# EasyEDA Pro project ProPrj_ESP32-CNC_2025-08-15.epro, schematic Schematic1
Board Name: Board1; Create Date: 2025-08-11; Page Name: P1; Project Name: ESP32-CNC; Schematic Name: Schematic1; Update Date: 2025-08-14; Company: EasyEDA.com; Page Size: A2; Version: V1.0
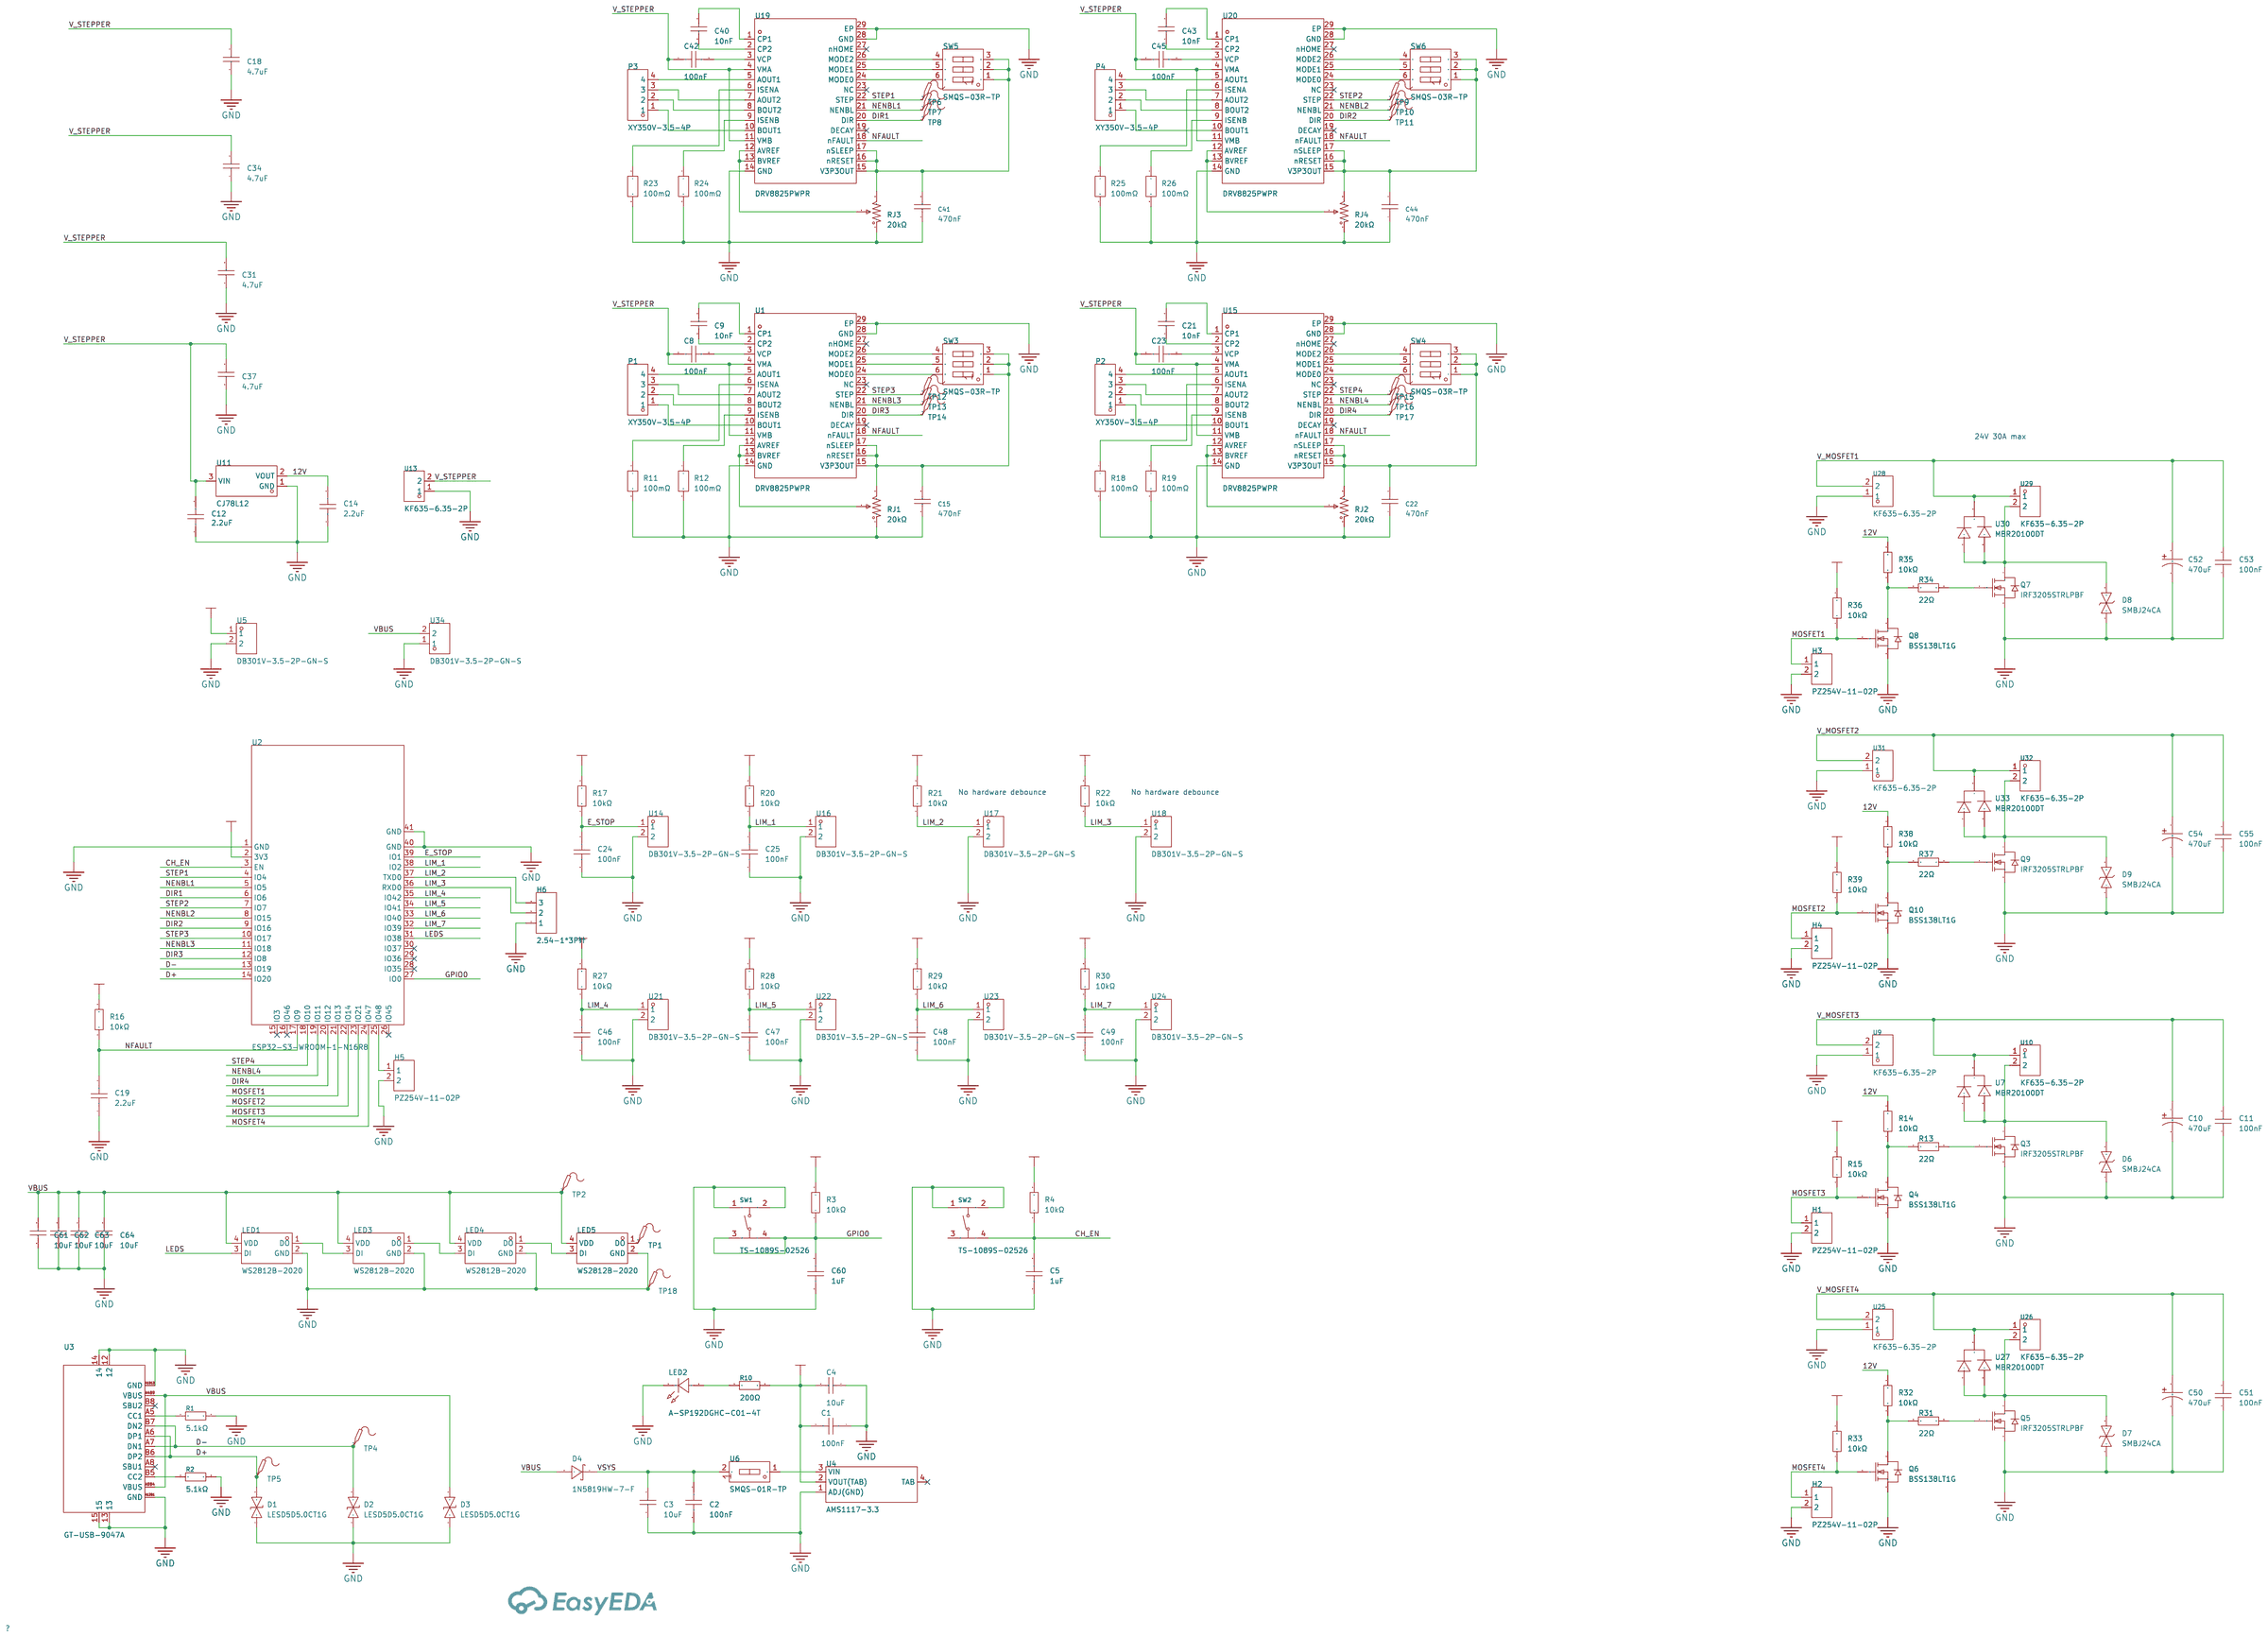
[diagram p0: schematic sheet]

## Parts
C1  100nF  [C0805]
C2  100nF  [C0805]
C3  10uF  [C0402]
C4  10uF  [C0402]
C5  1uF  [C0402]
C8  100nF  [C0805]
C9  10nF  [C0805]
C10  470uF  [CAP-SMD_BD12.5-L13.0-W13.0-RD]
C11  100nF  [C0805]
C12  2.2uF  [C0805]
C14  2.2uF  [C0805]
C15  470nF  [C0805]
C18  4.7uF  [C1206]
C19  2.2uF  [C0805]
C21  10nF  [C0805]
C22  470nF  [C0805]
C23  100nF  [C0805]
C24  100nF  [C0805]
C25  100nF  [C0805]
C31  4.7uF  [C1206]
C34  4.7uF  [C1206]
C37  4.7uF  [C1206]
C40  10nF  [C0805]
C41  470nF  [C0805]
C42  100nF  [C0805]
C43  10nF  [C0805]
C44  470nF  [C0805]
C45  100nF  [C0805]
C46  100nF  [C0805]
C47  100nF  [C0805]
C48  100nF  [C0805]
C49  100nF  [C0805]
C50  470uF  [CAP-SMD_BD12.5-L13.0-W13.0-RD]
C51  100nF  [C0805]
C52  470uF  [CAP-SMD_BD12.5-L13.0-W13.0-RD]
C53  100nF  [C0805]
C54  470uF  [CAP-SMD_BD12.5-L13.0-W13.0-RD]
C55  100nF  [C0805]
C60  1uF  [C0402]
C61  10uF  [C0402]
C62  10uF  [C0402]
C63  10uF  [C0402]
C64  10uF  [C0402]
D1  LESD5D5.0CT1G  [SOD-523_L1.2-W0.8-LS1.6-BI]
D2  LESD5D5.0CT1G  [SOD-523_L1.2-W0.8-LS1.6-BI]
D3  LESD5D5.0CT1G  [SOD-523_L1.2-W0.8-LS1.6-BI]
D4  1N5819HW-7-F  [SOD-123_L2.7-W1.6-LS3.7-RD]
D6  SMBJ24CA  [SMBG_L4.3-W3.6-LS6.2-BI]
D7  SMBJ24CA  [SMBG_L4.3-W3.6-LS6.2-BI]
D8  SMBJ24CA  [SMBG_L4.3-W3.6-LS6.2-BI]
D9  SMBJ24CA  [SMBG_L4.3-W3.6-LS6.2-BI]
H1  PZ254V-11-02P  [HDR-TH_2P-P2.54-V-M]
H2  PZ254V-11-02P  [HDR-TH_2P-P2.54-V-M]
H3  PZ254V-11-02P  [HDR-TH_2P-P2.54-V-M]
H4  PZ254V-11-02P  [HDR-TH_2P-P2.54-V-M]
H5  PZ254V-11-02P  [HDR-TH_2P-P2.54-V-M]
H6  2.54-1*3P针  [HDR-TH_3P-P2.54-V-M-1]
LED1  WS2812B-2020  [LED-SMD_4P-L2.0-W2.0-TL_WS2812B-2020]
LED2  A-SP192DGHC-C01-4T  [LED0603-FD]
LED3  WS2812B-2020  [LED-SMD_4P-L2.0-W2.0-TL_WS2812B-2020]
LED4  WS2812B-2020  [LED-SMD_4P-L2.0-W2.0-TL_WS2812B-2020]
LED5  WS2812B-2020  [LED-SMD_4P-L2.0-W2.0-TL_WS2812B-2020]
P1  XY350V-3.5-4P  [CONN-TH_XY350V-3.5-4P]
P2  XY350V-3.5-4P  [CONN-TH_XY350V-3.5-4P]
P3  XY350V-3.5-4P  [CONN-TH_XY350V-3.5-4P]
P4  XY350V-3.5-4P  [CONN-TH_XY350V-3.5-4P]
Q3  IRF3205STRLPBF  [TO-263-2_L10.0-W9.1-P5.08-LS15.2-TL]
Q4  BSS138LT1G  [SOT-23-3_L2.9-W1.6-P1.90-LS2.8-BR]
Q5  IRF3205STRLPBF  [TO-263-2_L10.0-W9.1-P5.08-LS15.2-TL]
Q6  BSS138LT1G  [SOT-23-3_L2.9-W1.6-P1.90-LS2.8-BR]
Q7  IRF3205STRLPBF  [TO-263-2_L10.0-W9.1-P5.08-LS15.2-TL]
Q8  BSS138LT1G  [SOT-23-3_L2.9-W1.6-P1.90-LS2.8-BR]
Q9  IRF3205STRLPBF  [TO-263-2_L10.0-W9.1-P5.08-LS15.2-TL]
Q10  BSS138LT1G  [SOT-23-3_L2.9-W1.6-P1.90-LS2.8-BR]
R1  5.1kΩ  [R0402]
R2  5.1kΩ  [R0402]
R3  10kΩ  [R0402]
R4  10kΩ  [R0402]
R10  200Ω  [R0402]
R11  100mΩ  [R1206]
R12  100mΩ  [R1206]
R13  22Ω  [R0603]
R14  10kΩ  [R0402]
R15  10kΩ  [R0402]
R16  10kΩ  [R0402]
R17  10kΩ  [R0402]
R18  100mΩ  [R1206]
R19  100mΩ  [R1206]
R20  10kΩ  [R0402]
R21  10kΩ  [R0402]
R22  10kΩ  [R0402]
R23  100mΩ  [R1206]
R24  100mΩ  [R1206]
R25  100mΩ  [R1206]
R26  100mΩ  [R1206]
R27  10kΩ  [R0402]
R28  10kΩ  [R0402]
R29  10kΩ  [R0402]
R30  10kΩ  [R0402]
R31  22Ω  [R0603]
R32  10kΩ  [R0402]
R33  10kΩ  [R0402]
R34  22Ω  [R0603]
R35  10kΩ  [R0402]
R36  10kΩ  [R0402]
R37  22Ω  [R0603]
R38  10kΩ  [R0402]
R39  10kΩ  [R0402]
RJ1  20kΩ  [RES-ADJ-SMD_TC33X-2-104E]
RJ2  20kΩ  [RES-ADJ-SMD_TC33X-2-104E]
RJ3  20kΩ  [RES-ADJ-SMD_TC33X-2-104E]
RJ4  20kΩ  [RES-ADJ-SMD_TC33X-2-104E]
SW1  TS-1089S-02526  [SW-SMD_4P-L4.2-W3.3-P2.15-LS5.1]
SW2  TS-1089S-02526  [SW-SMD_4P-L4.2-W3.3-P2.15-LS5.1]
SW3  SMQS-03R-TP  [SW-TH_SMQS-03B-TP]
SW4  SMQS-03R-TP  [SW-TH_SMQS-03B-TP]
SW5  SMQS-03R-TP  [SW-TH_SMQS-03B-TP]
SW6  SMQS-03R-TP  [SW-TH_SMQS-03B-TP]
TP1  -  [Test-Point-0.5mm]
TP2  -  [Test-Point-0.5mm]
TP4  -  [Test-Point-0.5mm]
TP5  -  [Test-Point-0.5mm]
TP6  -  [Test-Point-0.5mm]
TP7  -  [Test-Point-0.5mm]
TP8  -  [Test-Point-0.5mm]
TP9  -  [Test-Point-0.5mm]
TP10  -  [Test-Point-0.5mm]
TP11  -  [Test-Point-0.5mm]
TP12  -  [Test-Point-0.5mm]
TP13  -  [Test-Point-0.5mm]
TP14  -  [Test-Point-0.5mm]
TP15  -  [Test-Point-0.5mm]
TP16  -  [Test-Point-0.5mm]
TP17  -  [Test-Point-0.5mm]
TP18  -  [Test-Point-0.5mm]
U1  DRV8825PWPR  [HTSSOP-28_L9.7-W4.4-P0.65-LS6.4-BL-EP]
U2  ESP32-S3-WROOM-1-N16R8  [WIRELM-SMD_ESP32-S3-WROOM-1]
U3  GT-USB-9047A  [USB-C-SMD_GT-USB-9047A]
U4  AMS1117-3.3  [SOT-223-4_L6.5-W3.5-P2.30-LS7.0-BR]
U5  DB301V-3.5-2P-GN-S  [CONN-TH_DB301V-3.5-2P-GN]
U6  SMQS-01R-TP  [SW-TH_KF1001-01P-B0-FL-ON-01B]
U7  MBR20100DT  [TO-252-2_L6.5-W6.1-P4.58-LS10.0-BL]
U9  KF635-6.35-2P  [CONN-TH_P6.35_KF635-6.35-2P]
U10  KF635-6.35-2P  [CONN-TH_P6.35_KF635-6.35-2P]
U11  CJ78L12  [SOT-89-3_L4.5-W2.5-P1.50-LS4.2-BR]
U13  KF635-6.35-2P  [CONN-TH_P6.35_KF635-6.35-2P]
U14  DB301V-3.5-2P-GN-S  [CONN-TH_DB301V-3.5-2P-GN]
U15  DRV8825PWPR  [HTSSOP-28_L9.7-W4.4-P0.65-LS6.4-BL-EP]
U16  DB301V-3.5-2P-GN-S  [CONN-TH_DB301V-3.5-2P-GN]
U17  DB301V-3.5-2P-GN-S  [CONN-TH_DB301V-3.5-2P-GN]
U18  DB301V-3.5-2P-GN-S  [CONN-TH_DB301V-3.5-2P-GN]
U19  DRV8825PWPR  [HTSSOP-28_L9.7-W4.4-P0.65-LS6.4-BL-EP]
U20  DRV8825PWPR  [HTSSOP-28_L9.7-W4.4-P0.65-LS6.4-BL-EP]
U21  DB301V-3.5-2P-GN-S  [CONN-TH_DB301V-3.5-2P-GN]
U22  DB301V-3.5-2P-GN-S  [CONN-TH_DB301V-3.5-2P-GN]
U23  DB301V-3.5-2P-GN-S  [CONN-TH_DB301V-3.5-2P-GN]
U24  DB301V-3.5-2P-GN-S  [CONN-TH_DB301V-3.5-2P-GN]
U25  KF635-6.35-2P  [CONN-TH_P6.35_KF635-6.35-2P]
U26  KF635-6.35-2P  [CONN-TH_P6.35_KF635-6.35-2P]
U27  MBR20100DT  [TO-252-2_L6.5-W6.1-P4.58-LS10.0-BL]
U28  KF635-6.35-2P  [CONN-TH_P6.35_KF635-6.35-2P]
U29  KF635-6.35-2P  [CONN-TH_P6.35_KF635-6.35-2P]
U30  MBR20100DT  [TO-252-2_L6.5-W6.1-P4.58-LS10.0-BL]
U31  KF635-6.35-2P  [CONN-TH_P6.35_KF635-6.35-2P]
U32  KF635-6.35-2P  [CONN-TH_P6.35_KF635-6.35-2P]
U33  MBR20100DT  [TO-252-2_L6.5-W6.1-P4.58-LS10.0-BL]
U34  DB301V-3.5-2P-GN-S  [CONN-TH_DB301V-3.5-2P-GN]

## Library data of the parts
C1 C2 C8 C11 C23-C25 C42 C45-C49 C51 C53 C55 = CL21B104KCFNNNE: Capacitance: Tolerance:±10% Tolerance:±10% Voltage Rated: Temperature Coefficient:; LCSC Part Name: 100nF ±10% 100V; Supplier Part: C28233; Manufacturer: SAMSUNG(三星); Supplier Footprint: 0805; JLCPCB Part Class: Basic Part; Datasheet: https://atta.szlcsc.com/upload/public/pdf/source/20160218/1457707763339.pdf; Supplier: LCSC; Tolerance: ±10%
C3 C4 C61-C64 = CL05A106MQ5NUNC: Capacitance: Tolerance:±20% Tolerance:±20% Voltage Rated: Temperature Coefficient:; LCSC Part Name: 10uF ±20% 6.3V; Supplier Part: C15525; Manufacturer: SAMSUNG(三星); Supplier Footprint: 0402; JLCPCB Part Class: Basic Part; Datasheet: https://atta.szlcsc.com/upload/public/pdf/source/20220823/2B02EE04F8F211D38A52DCB16EB6BEBA.pdf; Supplier: LCSC; Tolerance: ±20%
C5 C60 = CL05A105KA5NQNC: Capacitance: Tolerance:±10% Tolerance:±10% Voltage Rated: Temperature Coefficient:; LCSC Part Name: 1uF ±10% 25V; Supplier Part: C52923; Manufacturer: SAMSUNG(三星); Supplier Footprint: 0402; JLCPCB Part Class: Basic Part; Datasheet: https://atta.szlcsc.com/upload/public/pdf/source/20160218/1457707763339.pdf; Supplier: LCSC; Tolerance: ±10%
C9 C21 C40 C43 = CL21B103KBANNNC: Capacitance: Tolerance:±10% Tolerance:±10% Voltage Rated: Temperature Coefficient:; LCSC Part Name: 10nF ±10% 50V; Supplier Part: C1710; Manufacturer: SAMSUNG(三星); Supplier Footprint: 0805; JLCPCB Part Class: Basic Part; Datasheet: https://atta.szlcsc.com/upload/public/pdf/source/20160218/1457707763339.pdf; Supplier: LCSC; Tolerance: ±10%
C10 C50 C52 C54 = RVT1H471M1213: Capacitance: Tolerance:±20% Tolerance:±20% Voltage Rating: Ripple Current:530mA@120Hz Equivalent Series Resistance(ESR):- Diameter: Height - Seated (Max): Lifetime:2000hrs@105℃ Operating Temperature:-40℃~+105℃ Operating Temperature:-40℃~+105℃; LCSC Part Name: 470uF ±20% 50V; Supplier Part: C90272; Manufacturer: ROQANG(容强); Supplier Footprint: SMD,D12.5xL13.5mm; JLCPCB Part Class: Extended Part; Datasheet: https://atta.szlcsc.com/upload/public/pdf/source/20220809/CF99377A6EA3F4895B6230BA7EE6A383.pdf; Supplier: LCSC; Tolerance: ±20%; Ripple Current: 530mA@120Hz; Lifetime: 2000hrs@105℃; Operating Temperature: -40℃~+105℃
C12 C14 C19 = CL21A225KBQNNNE: Capacitance: Tolerance:±10% Tolerance:±10% Voltage Rated: Temperature Coefficient:; LCSC Part Name: 2.2uF ±10% 50V; Supplier Part: C377773; Manufacturer: SAMSUNG(三星); Supplier Footprint: 0805; JLCPCB Part Class: Basic Part; Datasheet: https://atta.szlcsc.com/upload/public/pdf/source/20160218/1457707763339.pdf; Supplier: LCSC; Tolerance: ±10%
C15 C22 C41 C44 = CL21B474KBFNNNE: Capacitance: Tolerance:±10% Tolerance:±10% Voltage Rated: Temperature Coefficient:; LCSC Part Name: 470nF ±10% 50V; Supplier Part: C13967; Manufacturer: SAMSUNG(三星); Supplier Footprint: 0805; JLCPCB Part Class: Basic Part; Datasheet: https://atta.szlcsc.com/upload/public/pdf/source/20160218/1457707763339.pdf; Supplier: LCSC; Tolerance: ±10%
C18 C31 C34 C37 = 1206B475K500NT: Capacitance:4.7uF Tolerance:±10% Tolerance:±10% Voltage Rating:50V Temperature Coefficient:X7R; LCSC Part Name: 4.7uF ±10% 50V; Supplier Part: C29823; Manufacturer: FH(风华); Supplier Footprint: 1206; JLCPCB Part Class: Basic Part; Datasheet: https://atta.szlcsc.com/upload/public/pdf/source/20200305/C486355_26A10D38EF8C2A5C37091D0039909270.pdf; Supplier: LCSC; Tolerance: ±10%; Voltage Rating: 50V; Temperature Coefficient: X7R
D1-D3 = LESD5D5.0CT1G: Polarity:Bidirectional Reverse Stand-Off Voltage (Vrwm):5V Clamping Voltage:18.6V Peak Pulse Current (Ipp):9.4A Voltage - Breakdown:5.6V Type:ESD; LCSC Part Name: 双向ESD; Supplier Part: C383211; Manufacturer: LRC(乐山无线电); Supplier Footprint: SOD-523; JLCPCB Part Class: Extended Part; Datasheet: https://atta.szlcsc.com/upload/public/pdf/source/20190807/C383211_633DF4B4E2C161403226E5235FE33A1C.pdf; Supplier: LCSC; Polarity: Bidirectional; Reverse Stand-Off Voltage (Vrwm): 5V; Clamping Voltage: 18.6V; Peak Pulse Current (Ipp): 9.4A; Voltage - Breakdown: 5.6V; Type: ESD
D4 = 1N5819HW-7-F: Forward Voltage (Vf@If):450mV@1A Reverse Voltage (Vr):40V Rectified Current:1A Reverse Leakage Current (Ir):1mA@40V; LCSC Part Name: 电压:40V 电流:1A; Supplier Part: C82544; Manufacturer: DIODES(美台); Supplier Footprint: SOD-123; JLCPCB Part Class: Extended Part; Datasheet: https://atta.szlcsc.com/upload/public/pdf/source/20161024/1477288459223.pdf; Supplier: LCSC; Forward Voltage (Vf@If): 450mV@1A; Reverse Voltage (Vr): 40V; Rectified Current: 1A; Reverse Leakage Current (Ir): 1mA@40V
D6-D9 = SMBJ24CA_C19634091: Polarity:Bidirectional Reverse Stand-Off Voltage (Vrwm):24V Clamping Voltage:26.7V Peak Pulse Current (Ipp):15.5A Voltage - Breakdown:38.9V Reverse Leakage Current (Ir):1uA Type:TVS; LCSC Part Name: 双向TVS 24V截止 15.5A峰值脉冲; Supplier Part: C19634091; Manufacturer: JUXING(钜兴); Supplier Footprint: SMB; JLCPCB Part Class: Extended Part; Datasheet: https://atta.szlcsc.com/upload/public/pdf/source/20231215/390DCA7CC53A80D82F126F1A32DF96CA.pdf; Supplier: LCSC; Polarity: Bidirectional; Reverse Stand-Off Voltage (Vrwm): 24V; Clamping Voltage: 26.7V; Peak Pulse Current (Ipp): 15.5A; Voltage - Breakdown: 38.9V; Reverse Leakage Current (Ir): 1uA; Type: TVS
H1-H5 = PZ254V-11-02P: Pin Structure:1x2P Pitch:2.54mm Row Spacing:- Circluar Pins/Square Pins:Policy Mounting Type:Straight Number of Rows:Single Row Number of Pins:2P Current Rating:- Voltage Rating (Max):- Length of Mating Pin:6mm Insulation Height:2.5mm Length of End Connec; LCSC Part Name: 1x2P 间距:2.54mm 方针 直插; Supplier Part: C492401; Manufacturer: XFCN(兴飞); Supplier Footprint: 插件,P=2.54mm; JLCPCB Part Class: Extended Part; Datasheet: https://atta.szlcsc.com/upload/public/pdf/source/20200309/C492401_A812433581A9B211A7FFA413ADDFF0E5.pdf; Supplier: LCSC; Pin Structure: 1x2P; Pitch: 2.54mm; Circluar Pins/Square Pins: Policy; Mounting Type: Straight; Number of Rows: Single Row; Number of Pins: 2P; Length of Mating Pin: 6mm; Insulation Height: 2.5mm; Length of End Connection Pin: 3mm; Contact Material: Brass; Operating Temperature: -40℃~+105℃; Color: Black
H6 = 2.54-1*3P针: Pin Structure:1x3P Pitch:2.54mm Row Spacing:- Circluar Pins/Square Pins:Policy Mounting Type:Direct Insert Number of Rows:Single Row Number of Pins:3P Current Rating (Max):3A Voltage Rating (Max):- Length of Mating Pin:- Insulation Height:- Length of End; LCSC Part Name: 间距:2.54mm 1x3P 直插 方针; Supplier Part: C49257; Manufacturer: BOOMELE(博穆精密); Supplier Footprint: 插件,P=2.54mm; JLCPCB Part Class: Extended Part; Datasheet: https://atta.szlcsc.com/upload/public/pdf/source/20221018/3E9408392E35E6F57A28985E5F7BF5C9.pdf; Supplier: LCSC; Pin Structure: 1x3P; Pitch: 2.54mm; Circluar Pins/Square Pins: Policy; Mounting Type: Direct Insert; Number of Rows: Single Row; Number of Pins: 3P; Current Rating (Max): 3A; Operating Temperature Range: -40℃~+105℃; Color: Black
LED1 LED3-LED5 = WS2812B-2020: Wavelength:515.6nm；622.5nm；470.4nm Luminous Intensity:- Fixed-Frequency Pwm Mode:- Data Transmission Rate:- Supply Voltage:- Supply Voltage:- Quiescent Dissipation:- Lens Color:-; LCSC Part Name: RGB三色; Supplier Part: C965555; Manufacturer: worldsemi; Supplier Footprint: SMD,2x2mm; JLCPCB Part Class: Extended Part; Datasheet: https://atta.szlcsc.com/upload/public/pdf/source/20241202/DEE3FC25B8AD87F3BB1718ACD77EDECD.pdf; Supplier: LCSC; Wavelength: 515.6nm；622.5nm；470.4nm
LED2 = A-SP192DGHC-C01-4T: Emitted Color:Green Forward Voltage (VF):2.4V~3V Forward Voltage (VF):2.4V~3V Power Dissipation:70mW Dominant Wavelength:520nm~535nm Dominant Wavelength:520nm~535nm Lens Color:Colorless Transparent Lens Luminous Intensity:225mcd~450mcd Luminous Intensity:; LCSC Part Name: 0603高亮绿灯正贴; Supplier Part: C19171301; Manufacturer: Amicc(欧密格光电); Supplier Footprint: 0603; JLCPCB Part Class: Extended Part; Datasheet: https://atta.szlcsc.com/upload/public/pdf/source/20231108/CAA90604E374CB6B31BBE970B55159E7.pdf; Supplier: LCSC; Emitted Color: Green; Forward Voltage (VF): 2.4V~3V; Power Dissipation: 70mW; Dominant Wavelength: 520nm~535nm; Lens Color: Colorless Transparent Lens; Luminous Intensity: 225mcd~450mcd; Viewing Angle: 120°; Mounting Sytle: Positive Stick; Operating Temperature: -40℃~+85℃
P1-P4 = XY350V-3.5-4P: Number of Positions or Pins:1x4P Pitch:3.5mm Color:Green Mounting Type:Straight Number of Pins:4P Number of Rows:1 Number of PINs Per Row:4 Screw Specification:M2 Current Rating:7A Voltage Rating (Max):300V Wire Gauge - AWG:18~24 Wire Gauge - AWG:18~24 Wi; LCSC Part Name: 1x4P 3.5mm 直插 排数:1 每排P数:4; Supplier Part: C557656; Manufacturer: XINLAIYA(新莱亚); Supplier Footprint: 插件,P=3.5mm; JLCPCB Part Class: Extended Part; Datasheet: https://atta.szlcsc.com/upload/public/pdf/source/20200527/C557655_DACD9A2B7E89CB0723CF2F58FC34C45E.pdf; Supplier: LCSC; Number of Positions or Pins: 1x4P; Pitch: 3.5mm; Color: Green; Mounting Type: Straight; Number of Pins: 4P; Number of Rows: 1; Number of PINs Per Row: 4; Screw Specification: M2; Current Rating: 7A; Voltage Rating (Max): 300V; Wire Gauge - AWG: 18~24; Wire Gauge - mm2: 1
Q3 Q5 Q7 Q9 = IRF3205STRLPBF: Type:1 N-Channel Drain Source Voltage (Vdss): Continuous Drain Current (Id): Drain Source On Resistance (RDS(on)@Vgs,Id):8mΩ@10V,62A Power Dissipation (Pd): Gate Threshold Voltage (Vgs(th)@Id):2V@250uA Total Gate Charge (Qg@Vgs):146nC Input Capacitance (C; LCSC Part Name: 1个N沟道 耐压:55V 电流:110A; Supplier Part: C2613; Manufacturer: Infineon(英飞凌); Supplier Footprint: D2PAK; JLCPCB Part Class: Extended Part; Datasheet: https://atta.szlcsc.com/upload/public/pdf/source/20200421/C513202_CDD82EE1AF2A5F26D8E9031185F8B30B.pdf; Supplier: LCSC; Type: 1 N-Channel; Drain Source On Resistance (RDS(on)@Vgs,Id): 8mΩ@10V,62A; Gate Threshold Voltage (Vgs(th)@Id): 2V@250uA; Total Gate Charge (Qg@Vgs): 146nC; Input Capacitance (Ciss@Vds): 3247pF; Reverse Transfer Capacitance (Crss@Vds): 211pF; Operating Temperature: -55℃~+175℃
Q4 Q6 Q8 Q10 = BSS138LT1G: Type:1 N-Channel Drain Source Voltage (Vdss): Continuous Drain Current (Id): Drain Source On Resistance (RDS(on)@Vgs,Id):5.6Ω@2.75V Power Dissipation (Pd): Gate Threshold Voltage (Vgs(th)@Id):0.5V@1.0mA Input Capacitance (Ciss@Vds):50pF@25V Reverse Transf; LCSC Part Name: 1个N沟道 耐压:50V 电流:200mA Single N-Channel Logic Level Power MOSFET 50V, 200mA, 3.5Ω; Supplier Part: C82045; Manufacturer: onsemi(安森美); Supplier Footprint: SOT-23; JLCPCB Part Class: Extended Part; Datasheet: https://atta.szlcsc.com/upload/public/pdf/source/20160910/1473490306631.PDF; Supplier: LCSC; Type: 1 N-Channel; Drain Source On Resistance (RDS(on)@Vgs,Id): 5.6Ω@2.75V; Gate Threshold Voltage (Vgs(th)@Id): 0.5V@1.0mA; Input Capacitance (Ciss@Vds): 50pF@25V; Reverse Transfer Capacitance (Crss@Vds): 5pF@25V; Operating Temperature: -55℃~+150℃
R1 R2 = 0402WGF5101TCE: Type:Thick Film Resistor Resistance:5.1kΩ Tolerance:±1% Tolerance:±1% Power(Watts):62.5mW Voltage-Supply(Max):50V Temperature Coefficient:±100ppm/℃ Temperature Coefficient:±100ppm/℃ Operating Temperature:-55℃~+155℃ Operating Temperature:-55℃~+155℃; LCSC Part Name: 5.1kΩ ±1% 62.5mW 厚膜电阻; Supplier Part: C25905; Manufacturer: UNI-ROYAL(厚声); Supplier Footprint: 0402; JLCPCB Part Class: Basic Part; Datasheet: https://atta.szlcsc.com/upload/public/pdf/source/20200306/C422600_1E6D84923E4A46A82E41ADD87F860B5C.pdf; Supplier: LCSC; Type: Thick Film Resistor; Tolerance: ±1%; Power(Watts): 62.5mW; Voltage-Supply(Max): 50V; Temperature Coefficient: ±100ppm/℃; Operating Temperature: -55℃~+155℃
R3 R4 R14-R17 R20-R22 R27-R30 R32 R33 R35 R36 R38 R39 = 0402WGF1002TCE: Type:Thick Film Resistors Resistance:10kΩ Tolerance:±1% Tolerance:±1% Power(Watts): Overload Voltage (Max): Temperature Coefficient:±100ppm/℃ Temperature Coefficient:±100ppm/℃ Operating Temperature Range:-55℃~+155℃ Operating Temperature Range:-55℃~+155℃; LCSC Part Name: 10kΩ ±1% 62.5mW 厚膜电阻; Supplier Part: C25744; Manufacturer: UNI-ROYAL(厚声); Supplier Footprint: 0402; JLCPCB Part Class: Basic Part; Datasheet: https://atta.szlcsc.com/upload/public/pdf/source/20200306/C422600_1E6D84923E4A46A82E41ADD87F860B5C.pdf; Supplier: LCSC; Type: Thick Film Resistors; Tolerance: ±1%; Temperature Coefficient: ±100ppm/℃; Operating Temperature Range: -55℃~+155℃
R10 = 0402WGF2000TCE: Type:Thick Film Resistor Resistance:200Ω Tolerance:±1% Tolerance:±1% Power(Watts):62.5mW Voltage-Supply(Max):50V Temperature Coefficient:±100ppm/℃ Temperature Coefficient:±100ppm/℃ Operating Temperature:-55℃~+155℃ Operating Temperature:-55℃~+155℃; LCSC Part Name: 200Ω ±1% 62.5mW 厚膜电阻; Supplier Part: C25087; Manufacturer: UNI-ROYAL(厚声); Supplier Footprint: 0402; JLCPCB Part Class: Basic Part; Datasheet: https://atta.szlcsc.com/upload/public/pdf/source/20200306/C422600_1E6D84923E4A46A82E41ADD87F860B5C.pdf; Supplier: LCSC; Type: Thick Film Resistor; Tolerance: ±1%; Power(Watts): 62.5mW; Voltage-Supply(Max): 50V; Temperature Coefficient: ±100ppm/℃; Operating Temperature: -55℃~+155℃
R11 R12 R18 R19 R23-R26 = HoYH1206-1W-100mR-1%: Type:Current Sensing Resistors Resistance:100mΩ Tolerance:±1% Tolerance:±1% Power(Watts): Temperature Coefficient:±100ppm/℃ Temperature Coefficient:±100ppm/℃ Mounting Sytle:Patch; LCSC Part Name: 100mΩ ±1% 1W; Supplier Part: C601090; Manufacturer: Milliohm(毫欧); Supplier Footprint: 1206; JLCPCB Part Class: Extended Part; Datasheet: https://atta.szlcsc.com/upload/public/pdf/source/20200610/C601090_FD788C53A9F5B63C5ED3698A36C9038C.pdf; Supplier: LCSC; Type: Current Sensing Resistors; Tolerance: ±1%; Temperature Coefficient: ±100ppm/℃; Mounting Sytle: Patch
R13 R31 R34 R37 = 0603WAF220JT5E: Type:Thick Film Resistors Resistance:22Ω Tolerance:±1% Tolerance:±1% Power(Watts): Overload Voltage (Max): Temperature Coefficient:±100ppm/℃ Temperature Coefficient:±100ppm/℃ Operating Temperature Range:-55℃~+155℃ Operating Temperature Range:-55℃~+155℃; LCSC Part Name: 22Ω ±1% 100mW 厚膜电阻; Supplier Part: C23345; Manufacturer: UNI-ROYAL(厚声); Supplier Footprint: 0603; JLCPCB Part Class: Basic Part; Datasheet: https://atta.szlcsc.com/upload/public/pdf/source/20200306/C422600_1E6D84923E4A46A82E41ADD87F860B5C.pdf; Supplier: LCSC; Type: Thick Film Resistors; Tolerance: ±1%; Temperature Coefficient: ±100ppm/℃; Operating Temperature Range: -55℃~+155℃
RJ1-RJ4 = TC33X-2-203E: Resistance: Tolerance:±25% Tolerance:±25% Rated Voltage:- Power(Watts): Temperature Coefficient:±250ppm/℃ Temperature Coefficient:±250ppm/℃ Turns:; LCSC Part Name: 20kΩ ±25%; Supplier Part: C720648; Manufacturer: BOURNS; Supplier Footprint: SMD-3P,3.8x3.6mm; JLCPCB Part Class: Extended Part; Datasheet: https://atta.szlcsc.com/upload/public/pdf/source/20200810/C720646_BB66A75E654D5E1D30127FF45BCD3C26.pdf; Supplier: LCSC; Tolerance: ±25%; Temperature Coefficient: ±250ppm/℃
SW1 SW2 = TS-1089S-02526: Circuit:SPST Actuator Style:Oval button Mounting Style:Brick nogging Switch Length:4.2mm Switch Width:3.25mm Switch Height:2.5mm Contact Current:50mA Voltage Rating (DC):12V With Lamp:- Mechanical Life:-; LCSC Part Name: 4.2*3.25*2.5mm 立贴 轻触开关; Supplier Part: C455282; Manufacturer: XUNPU(讯普); Supplier Footprint: SMD,3.3x4.2mm; JLCPCB Part Class: Extended Part; Datasheet: https://atta.szlcsc.com/upload/public/pdf/source/20191118/C455282_2E86A26A9CC4FEF4662951C4D45ED672.pdf; Supplier: LCSC; Circuit: SPST; Actuator Style: Oval button; Mounting Style: Brick nogging; Switch Length: 4.2mm; Switch Width: 3.25mm; Switch Height: 2.5mm; Contact Current: 50mA; Voltage Rating (DC): 12V
SW3-SW6 = SMQS-03R-TP: Type:Flat Toggle, Raised Style Circuit:- Number of Positions:3 positions Pin Style:- Lead Pitch:2.54mm Current Rating:25mA Voltage Rating:24V Operating Temperature:-40℃~+85℃ Operating Temperature:-40℃~+85℃ Operating Life:5 Thousand Times Color:Red; LCSC Part Name: 间距2.54mm 平拨,凸起式3位拨码开关; Supplier Part: C5299504; Manufacturer: SM Switch; JLCPCB Part Class: Extended Part; Datasheet: https://atta.szlcsc.com/upload/public/pdf/source/20230428/BECBF613F67C0CF733CC6E01F0CA4E67.pdf; Supplier: LCSC; Type: Flat Toggle, Raised Style; Number of Positions: 3 positions; Lead Pitch: 2.54mm; Current Rating: 25mA; Voltage Rating: 24V; Operating Temperature: -40℃~+85℃; Operating Life: 5 Thousand Times; Color: Red
TP1 TP2 TP4-TP18 = Test-Point: Test Point 测试点
U1 U15 U19 U20 = DRV8825PWPR: Technology:- Voltage - Supply:- Voltage - Supply:- Output Current:- Output Current:- Interface:STEP/DIR Step Resolution:32 RDS(on):200mΩ Operating Temperature:-40℃~+85℃ Operating Temperature:-40℃~+85℃; LCSC Part Name: 2.5A 45V电机驱动芯片; Supplier Part: C81582; Manufacturer: TI(德州仪器); Supplier Footprint: HTSSOP-28-EP; JLCPCB Part Class: Extended Part; Datasheet: https://www.ti.com/cn/lit/gpn/drv8825; Supplier: LCSC; Interface: STEP/DIR; Step Resolution: 32; RDS(on): 200mΩ; Operating Temperature: -40℃~+85℃
U2 = ESP32-S3-WROOM-1-N16R8: LCSC Part Name: 通用型Wi-Fi+低功耗蓝牙MCU模组; Supplier Part: C2913202; Manufacturer: ESPRESSIF(乐鑫); Supplier Footprint: SMD,18x25.5mm; JLCPCB Part Class: Extended Part; Datasheet: https://item.szlcsc.com/datasheet/ESP32-S3-WROOM-1-N16R8/3198300.html; Supplier: LCSC
U3 = GT-USB-9047A: Connector Type:Type-C Protocol Standard:USB 2.0 Gender:Female Mounting Type:Surface Mount, Right Angle Number of Contacts:16P Number of Ports:1 Current Rating-Power:5A Voltage Rating:24V Connect-Disconnect Life:10,000 Cycles Supplementary Features:- Cente; LCSC Part Name: Type-C 母 卧贴; Supplier Part: C5117882; Manufacturer: G-Switch(品赞); Supplier Footprint: SMD; JLCPCB Part Class: Extended Part; Datasheet: https://atta.szlcsc.com/upload/public/pdf/source/20250507/517974E04384C576B41392852D87A3D7.pdf; Supplier: LCSC; Connector Type: Type-C; Protocol Standard: USB 2.0; Gender: Female; Mounting Type: Surface Mount, Right Angle; Number of Contacts: 16P; Number of Ports: 1; Current Rating-Power: 5A; Voltage Rating: 24V; Connect-Disconnect Life: 10,000 Cycles; Center Height: 1.68mm; Length: 7.35mm; Detection color: Black; Operating Temperature: -40℃~+85℃
U4 = AMS1117-3.3_C347222: Output Type:Fixed Voltage - Supply:12V Output Voltage:3.3V Output Voltage:3.3V Output Current:1A Power Supply Rejection Ratio (PSRR):60dB@(120Hz) Voltage Dropout:1.3V@(1A) standby current:- Noise:- Features:Overcurrent Protection Operating Temperature:- O; LCSC Part Name: 输出:3.3V 电流:1A 耐压:12V; Supplier Part: C347222; Manufacturer: UMW(友台半导体); Supplier Footprint: SOT-223; JLCPCB Part Class: Extended Part; Datasheet: https://item.szlcsc.com/datasheet/AMS1117-3.3/323882.html; Supplier: LCSC; Output Type: Fixed; Voltage - Supply: 12V; Output Voltage: 3.3V; Output Current: 1A; Power Supply Rejection Ratio (PSRR): 60dB@(120Hz); Voltage Dropout: 1.3V@(1A); Features: Overcurrent Protection; Output Configuration: Positive electrode; Number of Outputs: 1
U5 U14 U16-U18 U21-U24 U34 = DB301V-3.5-2P-GN-S: Number of Positions or Pins:1x2P Pitch:3.5mm Color:Green Mounting Type:Through Hole Number of Pins:2P Number of Rows:1 Number of PINs Per Row:2 Screw Specification:M2 Current Rating:7A Voltage Rating (Max):300V Wire Gauge - AWG:- Wire Gauge - AWG:- Wire G; LCSC Part Name: 1x2P 3.5mm 直插 排数:1 每排P数:2; Supplier Part: C695629; Manufacturer: DORABO(地博电气); Supplier Footprint: 插件,P=3.5mm; JLCPCB Part Class: Extended Part; Datasheet: https://atta.szlcsc.com/upload/public/pdf/source/20230106/1B95616A85A883CA085E21635C8A8490.pdf; Supplier: LCSC; Number of Positions or Pins: 1x2P; Pitch: 3.5mm; Color: Green; Mounting Type: Through Hole; Number of Pins: 2P; Number of Rows: 1; Number of PINs Per Row: 2; Screw Specification: M2; Current Rating: 7A; Voltage Rating (Max): 300V; Operating Temperature: -40℃~+105℃
U6 = SMQS-01R-TP: Type:Flat Toggle, Raised Style Circuit:- Number of Positions:1 Digit Pin Style:- Lead Pitch:- Current Rating:25mA Voltage Rating:24V Operating Temperature:-40℃~+85℃ Operating Temperature:-40℃~+85℃ Operating Life:5 Thousand Times Color:Red; LCSC Part Name: 平拨,凸起式1位拨码开关; Supplier Part: C5299502; Manufacturer: SM Switch; JLCPCB Part Class: Extended Part; Datasheet: https://atta.szlcsc.com/upload/public/pdf/source/20230428/BECBF613F67C0CF733CC6E01F0CA4E67.pdf; Supplier: LCSC; Type: Flat Toggle, Raised Style; Number of Positions: 1 Digit; Current Rating: 25mA; Voltage Rating: 24V; Operating Temperature: -40℃~+85℃; Operating Life: 5 Thousand Times; Color: Red
U7 U27 U30 U33 = MBR20100DT_C3011043: Diode Configuration:Independent Type Forward Voltage (Vf@If):850mV@10A Reverse Voltage (Vr):100V Rectified Current:20A Reverse Leakage Current (Ir):100uA@100V; LCSC Part Name: 电压:100V 电流:20A; Supplier Part: C3011043; Manufacturer: JUXING(钜兴); Supplier Footprint: TO-252; JLCPCB Part Class: Extended Part; Datasheet: https://atta.szlcsc.com/upload/public/pdf/source/20220513/7EA763EA0B88D85F04DE292D09B8CE4C.pdf; Supplier: LCSC; Diode Configuration: Independent Type; Forward Voltage (Vf@If): 850mV@10A; Reverse Voltage (Vr): 100V; Rectified Current: 20A; Reverse Leakage Current (Ir): 100uA@100V
U9 U10 U13 U25 U26 U28 U29 U31 U32 = KF635-6.35-2P: Structure:1x2P Pitch:6.35mm Color:Green Mounting Style:Straight Current Rating (Max):32A Voltage Rating (Max):450V Number of Pins:2P Number of Rows:1 Wire Gauge - AWG:10~22 Wire Gauge - AWG:10~22 Wire Gauge - mm2:4 Wire Gauge - mm2:4 Number of PINs Per Ro; LCSC Part Name: 6.35mm 1x2P 排数:1 每排P数:2 直插; Supplier Part: C475102; Manufacturer: KEFA(科发); Supplier Footprint: 插件,P=6.35mm; JLCPCB Part Class: Extended Part; Datasheet: https://atta.szlcsc.com/upload/public/pdf/source/20230317/51AC42F2E205921DAA0F567C0F76713A.pdf; Supplier: LCSC; Structure: 1x2P; Pitch: 6.35mm; Color: Green; Mounting Style: Straight; Current Rating (Max): 32A; Voltage Rating (Max): 450V; Number of Pins: 2P; Number of Rows: 1; Wire Gauge - AWG: 10~22; Wire Gauge - mm2: 4; Number of PINs Per Row: 2; Operating Temperature Range: -40℃~+105℃
U11 = CJ78L12_C8615: Output Type:Fixed Voltage - Supply:35V Output Voltage:12V Output Voltage:12V Output Current:100mA Power Supply Rejection Ratio (PSRR):42dB@(120Hz) Voltage Dropout:1.7V@(40mA) standby current:4.3mA Noise:70uV Operating Temperature:0℃~+150℃@(Tj) Operating T; LCSC Part Name: 输入35V 输出12V 100mA; Supplier Part: C8615; Manufacturer: CJ(江苏长电/长晶); Supplier Footprint: SOT-89-3L; JLCPCB Part Class: Extended Part; Datasheet: https://atta.szlcsc.com/upload/public/pdf/source/20140508/1457707058232.pdf; Supplier: LCSC; Output Type: Fixed; Voltage - Supply: 35V; Output Voltage: 12V; Output Current: 100mA; Power Supply Rejection Ratio (PSRR): 42dB@(120Hz); Voltage Dropout: 1.7V@(40mA); standby current: 4.3mA; Noise: 70uV; Operating Temperature: 0℃~+150℃@(Tj); Output Configuration: Positive; Number of Outputs: 1

## Nets
3V3: C1.2 C4.2 R3.2 R4.2 R10.2 R15.2 R16.2 R17.2 R20.2 R21.2 R22.2 R27.2 R28.2 R29.2 R30.2 R33.2 R36.2 R39.2 U2.2(3V3) U4.2(VOUT(TAB)) U5.1
12V: C14.2 R14.2 R32.2 R35.2 R38.2 U11.2(VOUT)
GND: C1.1 C2.2 C3.1 C4.1 C5.1 C10.2 C11.1 C12.1 C14.1 C15.1 C18.1 C19.1 C22.1 C24.2 C25.2 C31.1 C34.1 C37.1 C41.1 C44.1 C46.2 C47.2 C48.2 C49.2 C50.2 C51.1 C52.2 C53.1 C54.2 C55.1 C60.1 C61.2 C62.2 C63.2 C64.2 D1.1 D2.1 D3.1 D6.1 D7.1 D8.1 D9.1 H1.2 H2.2 H3.2 H4.2 H5.2 H6.1 LED1.2(GND) LED2.1(K) LED3.2(GND) LED4.2(GND) LED5.2(GND) Q3.3(S) Q4.2(S) Q5.3(S) Q6.2(S) Q7.3(S) Q8.2(S) Q9.3(S) Q10.2(S) R1.2 R2.2 R11.2 R12.2 R18.2 R19.2 R23.2 R24.2 R25.2 R26.2 RJ1.1 RJ2.1 RJ3.1 RJ4.1 SW1.1 SW1.2 SW2.1 SW2.2 TP18.1 U1.14(GND) U1.28(GND) U1.29(EP) U2.1(GND) U2.40(GND) U2.41(GND) U3.12 U3.13 U3.14 U3.15 U3.A1B12(GND) U3.A12B1(GND) U4.1(ADJ(GND)) U5.2 U9.1 U11.1(GND) U13.1 U14.2 U15.14(GND) U15.28(GND) U15.29(EP) U16.2 U17.2 U18.2 U19.14(GND) U19.28(GND) U19.29(EP) U20.14(GND) U20.28(GND) U20.29(EP) U21.2 U22.2 U23.2 U24.2 U25.1 U28.1 U31.1 U34.1
VBUS: C61.1 C62.1 C63.1 C64.1 D3.2 D4.2(A) LED1.4(VDD) LED3.4(VDD) LED4.4(VDD) LED5.4(VDD) TP2.1 U3.A4B9(VBUS) U3.A9B4(VBUS) U34.2
CH_EN: C5.2 R4.1 SW2.4 U2.3(EN)
D+: D1.2 TP5.1 U2.14(IO20) U3.A6(DP1) U3.B6(DP2)
D-: D2.2 TP4.1 U2.13(IO19) U3.A7(DN1) U3.B7(DN2)
DIR1: TP8.1 U2.6(IO6) U19.20(DIR)
DIR2: TP11.1 U2.9(IO16) U20.20(DIR)
DIR3: TP14.1 U1.20(DIR) U2.12(IO8)
DIR4: TP17.1 U2.20(IO12) U15.20(DIR)
E_STOP: C24.1 R17.1 U2.39(IO1) U14.1
GPIO0: C60.2 R3.1 SW1.3 SW1.4 U2.27(IO0)
LEDS: LED1.3(DI) U2.31(IO38)
LIM_1: C25.1 R20.1 U2.38(IO2) U16.1
LIM_2: H6.3 R21.1 U2.37(TXD0) U17.1
LIM_3: H6.2 R22.1 U2.36(RXD0) U18.1
LIM_4: C46.1 R27.1 U2.35(IO42) U21.1
LIM_5: C47.1 R28.1 U2.34(IO41) U22.1
LIM_6: C48.1 R29.1 U2.33(IO40) U23.1
LIM_7: C49.1 R30.1 U2.32(IO39) U24.1
MOSFET1: H3.1 Q8.1(G) R36.1 U2.21(IO13)
MOSFET2: H4.1 Q10.1(G) R39.1 U2.22(IO14)
MOSFET3: H1.1 Q4.1(G) R15.1 U2.23(IO21)
MOSFET4: H2.1 Q6.1(G) R33.1 U2.24(IO47)
NENBL1: TP7.1 U2.5(IO5) U19.21(NENBL)
NENBL2: TP10.1 U2.8(IO15) U20.21(NENBL)
NENBL3: TP13.1 U1.21(NENBL) U2.11(IO18)
NENBL4: TP16.1 U2.19(IO11) U15.21(NENBL)
NFAULT: C19.2 R16.1 U1.18(nFAULT) U2.17(IO9) U15.18(nFAULT) U19.18(nFAULT) U20.18(nFAULT)
STEP1: TP6.1 U2.4(IO4) U19.22(STEP)
STEP2: TP9.1 U2.7(IO7) U20.22(STEP)
STEP3: TP12.1 U1.22(STEP) U2.10(IO17)
STEP4: TP15.1 U2.18(IO10) U15.22(STEP)
V_MOSFET1: C52.1 C53.2 U28.2 U29.1 U30.2(K)
V_MOSFET2: C54.1 C55.2 U31.2 U32.1 U33.2(K)
V_MOSFET3: C10.1 C11.2 U7.2(K) U9.2 U10.1
V_MOSFET4: C50.1 C51.2 U25.2 U26.1 U27.2(K)
V_STEPPER: C8.1 C12.2 C18.2 C23.1 C31.2 C34.2 C37.2 C42.1 C45.1 U1.4(VMA) U1.11(VMB) U11.3(VIN) U13.2 U15.4(VMA) U15.11(VMB) U19.4(VMA) U19.11(VMB) U20.4(VMA) U20.11(VMB)
VSYS: C2.1 C3.2 D4.1(K) U6.2
$1N1589: R2.1 U3.B5(CC2)
$1N1590: R1.1 U3.A5(CC1)
$1N4191: LED2.2(A) R10.1
$1N4483: LED1.1(DO) LED3.3(DI)
$1N4489: LED3.1(DO) LED4.3(DI)
$1N4496: LED4.1(DO) LED5.3(DI)
$1N5697: RJ1.2 U1.12(AVREF) U1.13(BVREF)
$1N5816: C15.2 RJ1.3 SW3.1 SW3.2 SW3.3 U1.15(V3P3OUT) U1.16(nRESET) U1.17(nSLEEP)
$1N6278: C8.2 U1.3(VCP)
$1N6351: C9.2 U1.1(CP1)
$1N6357: C9.1 U1.2(CP2)
$1N6441: P1.3 U1.7(AOUT2)
$1N6459: P1.2 U1.8(BOUT2)
$1N6477: P1.1 U1.10(BOUT1)
$1N6621: R12.1 U1.9(ISENB)
$1N6629: R11.1 U1.6(ISENA)
$1N6899: U4.3(VIN) U6.1
$1N7080: D6.2 Q3.4(D) U7.1(A) U7.3(A) U10.2
$1N7575: Q3.1(G) R13.2
$1N8736: Q4.3(D) R13.1 R14.1
$1N10964: RJ2.2 U15.12(AVREF) U15.13(BVREF)
$1N10970: C22.2 RJ2.3 SW4.1 SW4.2 SW4.3 U15.15(V3P3OUT) U15.16(nRESET) U15.17(nSLEEP)
$1N11009: C23.2 U15.3(VCP)
$1N11011: C21.2 U15.1(CP1)
$1N11016: C21.1 U15.2(CP2)
$1N11021: P2.3 U15.7(AOUT2)
$1N11025: P2.2 U15.8(BOUT2)
$1N11029: P2.1 U15.10(BOUT1)
$1N11033: R19.1 U15.9(ISENB)
$1N11038: R18.1 U15.6(ISENA)
$1N13018: RJ3.2 U19.12(AVREF) U19.13(BVREF)
$1N13024: C41.2 RJ3.3 SW5.1 SW5.2 SW5.3 U19.15(V3P3OUT) U19.16(nRESET) U19.17(nSLEEP)
$1N13063: C42.2 U19.3(VCP)
$1N13065: C40.2 U19.1(CP1)
$1N13070: C40.1 U19.2(CP2)
$1N13075: P3.3 U19.7(AOUT2)
$1N13079: P3.2 U19.8(BOUT2)
$1N13083: P3.1 U19.10(BOUT1)
$1N13087: R24.1 U19.9(ISENB)
$1N13092: R23.1 U19.6(ISENA)
$1N13121: RJ4.2 U20.12(AVREF) U20.13(BVREF)
$1N13127: C44.2 RJ4.3 SW6.1 SW6.2 SW6.3 U20.15(V3P3OUT) U20.16(nRESET) U20.17(nSLEEP)
$1N13166: C45.2 U20.3(VCP)
$1N13168: C43.2 U20.1(CP1)
$1N13173: C43.1 U20.2(CP2)
$1N13178: P4.3 U20.7(AOUT2)
$1N13182: P4.2 U20.8(BOUT2)
$1N13186: P4.1 U20.10(BOUT1)
$1N13190: R26.1 U20.9(ISENB)
$1N13195: R25.1 U20.6(ISENA)
$1N14832: D7.2 Q5.4(D) U26.2 U27.1(A) U27.3(A)
$1N14842: Q5.1(G) R31.2
$1N14857: Q6.3(D) R31.1 R32.1
$1N15959: D8.2 Q7.4(D) U29.2 U30.1(A) U30.3(A)
$1N15969: Q7.1(G) R34.2
$1N15984: Q8.3(D) R34.1 R35.1
$1N16017: D9.2 Q9.4(D) U32.2 U33.1(A) U33.3(A)
$1N16027: Q9.1(G) R37.2
$1N16042: Q10.3(D) R37.1 R38.1
$1N16499: H5.1 U2.25(IO48)
$1N21869: P3.4 U19.5(AOUT1)
$1N21900: P4.4 U20.5(AOUT1)
$1N21931: P1.4 U1.5(AOUT1)
$1N21962: P2.4 U15.5(AOUT1)
$1N26684: SW3.4 U1.26(MODE2)
$1N26689: SW3.5 U1.25(MODE1)
$1N26694: SW3.6 U1.24(MODE0)
$1N31357: SW4.4 U15.26(MODE2)
$1N31361: SW4.5 U15.25(MODE1)
$1N31366: SW4.6 U15.24(MODE0)
$1N31401: SW6.4 U20.26(MODE2)
$1N31405: SW6.5 U20.25(MODE1)
$1N31410: SW6.6 U20.24(MODE0)
$1N31447: SW5.4 U19.26(MODE2)
$1N31451: SW5.5 U19.25(MODE1)
$1N31456: SW5.6 U19.24(MODE0)
Net-(LED5-1): LED5.1(DO) TP1.1

Not connected (* = marked no-connect by the designer): SW2 3; U1 19(DECAY)* 23(NC)* 27(nHOME)*; U2 15(IO3)* 16(IO46)* 26(IO45)* 28(IO35)* 29(IO36)* 30(IO37)*; U3 A8(SBU1)* B8(SBU2)*; U4 4(TAB)*; U15 19(DECAY)* 23(NC)* 27(nHOME)*; U19 19(DECAY)* 23(NC)* 27(nHOME)*; U20 19(DECAY)* 23(NC)* 27(nHOME)*

## Notes on the sheet
- 24V 30A max
- No hardware debounce
- No hardware debounce
